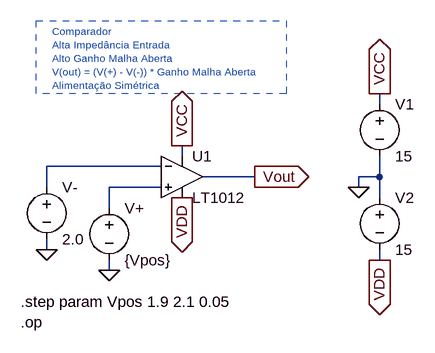
[diagram p0: schematic OpAmp_COMP.asc]
OpAmp_COMP.asc, the LTspice schematic file:
Version 4
SHEET 1 1048 680
WIRE 576 32 576 16
WIRE 272 112 272 96
WIRE 240 128 64 128
WIRE 384 144 304 144
WIRE 576 144 576 112
WIRE 576 144 544 144
WIRE 64 160 64 128
WIRE 240 160 160 160
WIRE 544 160 544 144
WIRE 576 176 576 144
WIRE 160 192 160 160
WIRE 64 256 64 240
WIRE 576 272 576 256
WIRE 160 288 160 272
FLAG 544 160 0
FLAG 576 16 VCC
IOPIN 576 16 Out
FLAG 576 272 VDD
IOPIN 576 272 Out
FLAG 272 96 VCC
IOPIN 272 96 Out
FLAG 272 176 VDD
IOPIN 272 176 Out
FLAG 384 144 Vout
IOPIN 384 144 Out
FLAG 160 288 0
FLAG 64 256 0
SYMBOL Opamps\\LT1012 272 80 R0
SYMATTR InstName U1
SYMBOL voltage 576 16 R0
SYMATTR InstName V1
SYMATTR Value 15
SYMBOL voltage 576 160 R0
SYMATTR InstName V2
SYMATTR Value 15
SYMBOL voltage 160 176 R0
WINDOW 123 0 0 Left 0
WINDOW 39 0 0 Left 0
SYMATTR InstName V+
SYMATTR Value {Vpos}
SYMBOL voltage 64 144 R0
WINDOW 123 0 0 Left 0
WINDOW 39 0 0 Left 0
SYMATTR InstName V-
SYMATTR Value 2.0
TEXT 24 336 Left 2 !.step param Vpos 1.9 2.1 0.05
TEXT 72 -80 Left 1 ;Comparador\nAlta Impedância Entrada\nAlto Ganho Malha Aberta\nV(out) = (V(+) - V(-)) * Ganho Malha Aberta\nAlimentação Simétrica
TEXT 24 368 Left 2 !.op
RECTANGLE Normal 432 16 48 -96 2

The netlist it stands for:
* OpAmp_COMP.asc
XU1 N002 N001 VCC VDD Vout LT1012  ; pins In+ In- V+ V- OUT
V1 VCC 0 15
V2 0 VDD 15
V+ N002 0 {Vpos}
V- N001 0 2.0
.step param Vpos 1.9 2.1 0.05
* Comparador
* Alta Impedância Entrada
* Alto Ganho Malha Aberta
* V(out) = (V(+) - V(-)) * Ganho Malha Aberta
* Alimentação Simétrica
.op
.backanno
.end